# EAGLE design Task6PCB (EAGLE 9.6.0)
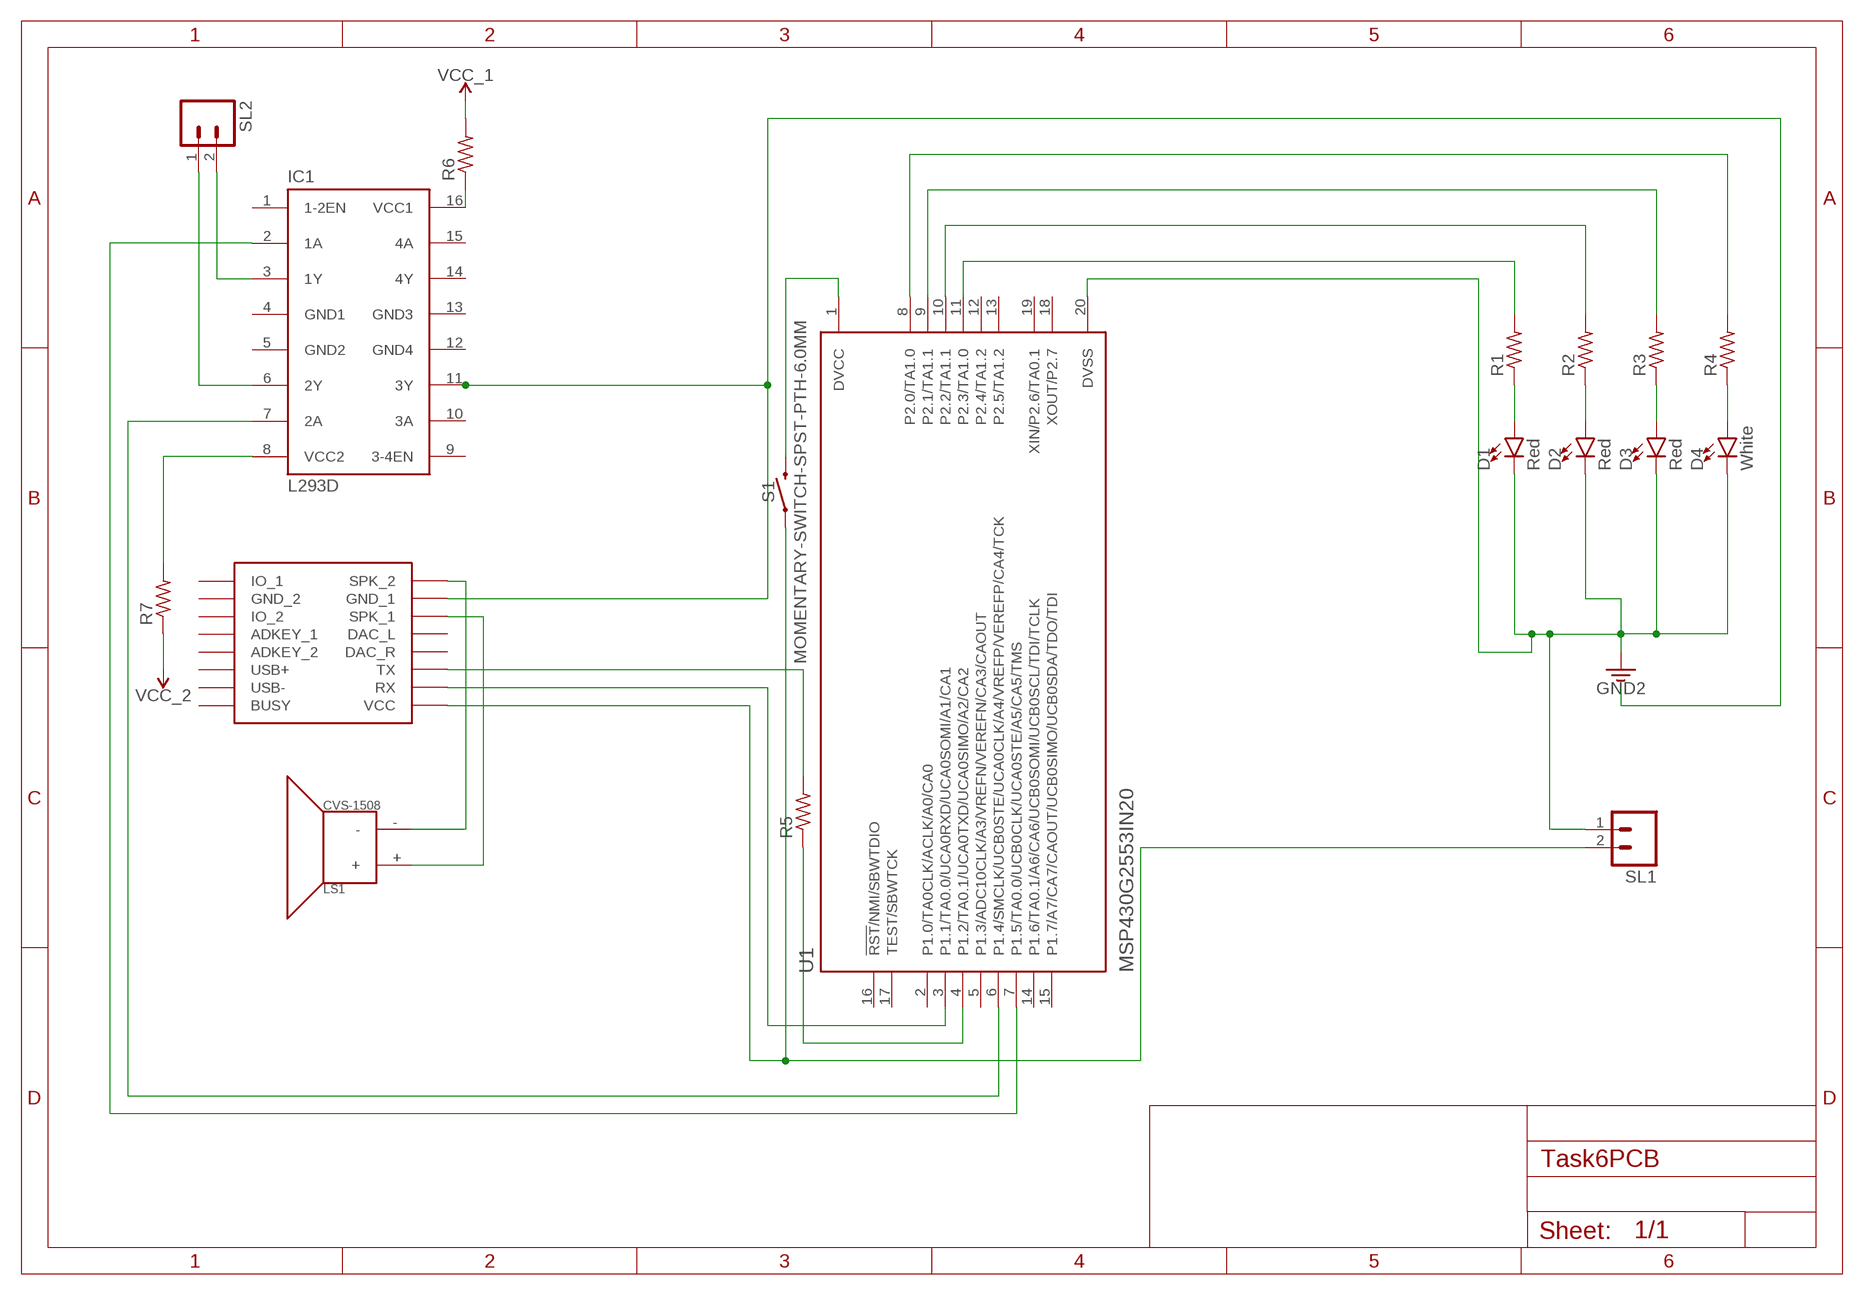
[diagram p0: schematic, sheet 1]

## Parts
D1  Red  LED-BLUE-0603-WE  [LED-0603]
D2  Red  LED-GREEN-0603-WE  [LED-0603]
D3  Red  LED-RED-0603-WE  [LED-0603]
D4  White  LED-PINK1206  [LED-1206]
IC1  L293D  [DIL16]
LS1  CVS-1508  SPEAKERCVS-1508  [CVS-1508_PCBSPKR]
R1  R-US_0204/7  [0204/7]
R2  R-US_0204/7  [0204/7]
R3  R-US_0204/7  [0204/7]
R4  R-US_0204/7  [0204/7]
R5  R-US_0204/7  [0204/7]
R6  R-US_0204/7  [0204/7]
R7  R-US_0204/7  [0204/7]
S1  MOMENTARY-SWITCH-SPST-PTH-6.0MM  [TACTILE_SWITCH_PTH_6.0MM]
SL1  M02  [02P]
SL2  M02  [02P]
U1  MSP430G2553IN20  [DIP794W45P254L2540H508Q20]
U$1  DFPLAYER  [DFPLAYER]

## Nets
3.3V: D1.C D2.C D3.C D4.C SL1.1 U1.20(DVSS) ; supply symbol labelled GND2
N$1: R5.1 U1.4(P1.2/TA0.1/UCA0TXD/UCA0SIMO/A2/CA2)
N$2: R2.2 U1.10(P2.2/TA1.1)
N$3: IC1.7(2A) U1.6(P1.4/SMCLK/UCB0STE/UCA0CLK/A4/VREFP/VEREFP/CA4/TCK)
N$4: IC1.8(VCC2) R7.2
N$5: D1.A R1.1
N$6: D4.A R4.1
N$7: R3.2 U1.9(P2.1/TA1.1)
N$8: D3.A R3.1
N$9: R4.2 U1.8(P2.0/TA1.0)
N$10: D2.A R2.1
N$11: U1.3(P1.1/TA0.0/UCA0RXD/UCA0SOMI/A1/CA1) U$1.RX
N$12: R5.2 U$1.TX
N$13: R1.2 U1.11(P2.3/TA1.0)
N$14: LS1.+ U$1.SPK1(SPK_1)
N$15: LS1.- U$1.SPK2(SPK_2)
N$16: IC1.16(VCC1) R6.1
N$17: S1.1 SL1.2 U$1.VCC
N$19: IC1.11(3Y) U$1.GND_1
N$20: IC1.3(1Y) SL2.2
N$21: IC1.6(2Y) SL2.1
N$22: S1.3 U1.1(DVCC)
N$24: IC1.2(1A) U1.7(P1.5/TA0.0/UCB0CLK/UCA0STE/A5/CA5/TMS)
VCC_1: R6.2
VCC_2: R7.1
Unconnected: IC1.1(1-2EN) IC1.9(3-4EN) IC1.10(3A) IC1.14(4Y) IC1.15(4A) U1.2(P1.0/TA0CLK/ACLK/A0/CA0) U1.5(P1.3/ADC10CLK/A3/VREFN/VEREFN/CA3/CAOUT) U1.12(P2.4/TA1.2) U1.13(P2.5/TA1.2) U1.14(P1.6/TA0.1/A6/CA6/UCB0SOMI/UCB0SCL/TDI/TCLK) U1.15(P1.7/A7/CA7/CAOUT/UCB0SIMO/UCB0SDA/TDO/TDI) U1.16(!RST!/NMI/SBWTDIO) U1.17(TEST/SBWTCK) U1.18(XOUT/P2.7) U1.19(XIN/P2.6/TA0.1) U$1.ADKEY1(ADKEY_1) U$1.ADKEY2(ADKEY_2) U$1.BUSY U$1.DAC_L U$1.DAC_R U$1.GND_2 U$1.IO1(IO_1) U$1.IO2(IO_2) U$1.USB+ U$1.USB-

## Power pins joined to a net without a drawn wire
GND1: IC1.4(GND1)
GND2: IC1.5(GND2)
GND3: IC1.13(GND3)
GND4: IC1.12(GND4)

## Library data of the parts
D1 = SparkFun-LED:LED-BLUE: Blue SMD LED Used in manufacturing of various products at SparkFun Packages: 0603 - SMD 0603 package [Product Link] <http://www.digikey.com/product-detail/en/SMLE12BC7TT86/511-1589-2-ND/1641808> 1206 - SMD1206 package [Product Link] <http://www.digikey.com/product-detail/en/lite-on-inc/LTST-C150TBKT/160-1643-1-ND/573584> SparkFun Products: ESP8266 Thing-Dev Board <https://www.sparkfun.com/products/13711> RedBoard <https://www.sparkfun.com/products/12757>; PROD_ID: DIO-16513; VALUE: Blue
D2 = SparkFun-LED:LED-GREEN: Green SMD LED Used in manufacturing of various products at SparkFun Packages: 0603 - SMD 0603 package [Product Link] <http://www.futureelectronics.com/en/technologies/semiconductors/optoelectronics/leds/Pages/9894312-LTST-C190GKT.aspx?CrossPart=HSMG-C190&IM=0> LilyPad 1206 - SMD1206 LilyPad package [Product Link] <http://www.futureelectronics.com/en/Technologies/Product.aspx?ProductID=IN150NGHARVATEKCORPORATION2049943&IM=0> 1206 - SMD1206 package [Product Link] <http://www.futureelectronics.com/en/technologies/semiconductors/optoelectronics/leds/Pages/8315665-LTST-C150KGKT.aspx?IM=0> 1206 Bottom Mount -SMD 1206 Bottom Mount [Product Link] <http://www.digikey.com/product-detail/en/lite-on-inc/LTST-C230KGKT/160-1456-1-ND/386854> SparkFun Products: Pro Mini 328 -5V <https://www.sparkfun.com/products/821> RedBoard <https://www.sparkfun.com/products/12757> MP3 Trigger <https://www.sparkfun.com/products/13720> Makey Makey <https://www.sparkfun.com/products/11076>; PROD_ID: DIO-16512; VALUE: Green
D3 = SparkFun-LED:LED-RED: Red SMD LED Used in manufacturing of most products at SparkFun Packages: 0603 - KB - KingBright (DIO-17976) SMD 0603 package [Datasheet] <https://www.kingbrightusa.com/images/catalog/SPEC/APT1608SURCK.pdf> 0603 - (DIO-00819, has gone EOL) SMD 0603 package 0603 SMART - SMD 0603 SMART package ( more efficient and expensive)[Product Link] <http://www.osram-os.com/Graphics/XPic2/00077099_0.pdf> 1206 - SMD1206 package [Product Link] <https://www.sparkfun.com/datasheets/DevTools/LilyPad/Q150OVS4.pdff> SparkFun Products: Pro Mini 328 -5V <https://www.sparkfun.com/products/821> RedBoard <https://www.sparkfun.com/products/12757> IOIO-OTG <https://www.sparkfun.com/products/13613>; PROD_ID: DIO-16511
D4 = SparkFun-LED:LED-PINK: Pink SMD LED Used in manufacturing of various products at SparkFun Packages: 0603 - SMD 0603 package [Product Link] <http://cdn.sparkfun.com/datasheets/Components/General/S1206PKSBJC.pdf> SparkFun Products: LilyPad LED Pink <https://www.sparkfun.com/products/10962>; PROD_ID: DIO-10415; VALUE: Pink
IC1 = st-microelectronics:L293D: PUSH-PULL 4 CHANNEL DRIVER; MPN: L293D; OC_FARNELL: 9589619; OC_NEWARK: 56P8249
LS1 = SparkFun-Electromechanical:SPEAKER: Speaker Generic 2-terminal loudspeakers SparkFun Products Speaker - PCB Mount <https://www.sparkfun.com/products/11089> (COM-11089); PROD_ID: COM-14823
R1-R7 = rcl:R-US_: RESISTOR, American symbol; SPICEPREFIX: R
S1 = SparkFun-Switches:MOMENTARY-SWITCH-SPST: Momentary Switch (Pushbutton) - SPST Normally-open (NO) SPST momentary switches (buttons, pushbuttons). Variants PTH-12MM - 12mm square, through-hole Momentary Pushbutton Switch - 12mm Square <https://www.sparkfun.com/products/9190> (COM-09190) PTH-6.0MM, PTH-6.0MM-KIT - 6.0mm square, through-hole Mini Pushbutton Switch <https://www.sparkfun.com/products/97> (COM-00097) KIT package intended for soldering kit's - only one side of pads' copper is exposed. PTH-RIGHT-ANGLE-KIT - Right-angle, through-hole Right Angle Tactile Button <https://www.sparkfun.com/products/10791> - Used on SparkFun BigTime Watch Kit <https://www.sparkfun.com/products/11734> SMD-12MM - 12mm square, surface-mount Tactile Button - SMD (12mm) <https://www.sparkfun.com/products/12993> (COM-12993) Used on SparkFun PicoBoard <https://www.sparkfun.com/products/11888> SMD-4.5MM - 4.5mm Square Trackball Switch Used on SparkFun Blackberry Trackballer Breakout <https://www.sparkfun.com/products/13169> SMD-4.6MMX2.8MM - 4.60mm x 2.80mm, surface mount Used on SparkFun Pro Micro - RP2040 <https://www.sparkfun.com/products/17717> SMD-5.2MM, SMD-5.2-REDUNDANT - 5.2mm square, surface-mount Mini Pushbutton Switch - SMD <https://www.sparkfun.com/products/8720> (COM-08720) Used on Arduino Pro Mini <https://www.sparkfun.com/products/11114> REDUNDANT package connects both switch circuits together SMD-6.0X3.5MM - 6.0 x 3.5mm, surface mount Momentary Reset Switch SMD <https://www.sparkfun.com/products/8229> (COM-08229) SMD-6.2MM-TALL - 6.2mm square, surface mount Tactile Button - SMD (6mm) <https://www.sparkfun.com/products/12992> Used on SparkFun Digital Sandbox <https://www.sparkfun.com/products/12651> SMD-RIGHT-ANGLE - Right-angle, surface mount Used on SparkFun Block for Intel® Edison - Arduino <https://www.sparkfun.com/products/13036>; PROD_ID: SWCH-08441; SF_SKU: COM-00097
SL1 SL2 = con-amp-quick:M02: AMP QUICK CONNECTOR; OC_FARNELL: unknown; OC_NEWARK: unknown
U1 = MSP430G2553IN20:MSP430G2553IN20: Check availability <https://pricing.snapeda.com/parts/MSP430G2553IN20/Texas%20Instruments/view-part?ref=eda>; AVAILABILITY: In Stock; CHECK_PRICES: https://www.snapeda.com/parts/MSP430G2553IN20/Texas+Instruments/view-part/?ref=eda; DESCRIPTION: 16 MHz MCU with 16KB Flash, 512B SRAM, comparator, UART/SPI/I2C, timer; MF: Texas Instruments; MP: MSP430G2553IN20; PACKAGE: PDIP-20 Texas Instruments; PRICE: None; PURCHASE-URL: https://www.snapeda.com/api/url_track_click_mouser/?unipart_id=46372&manufacturer=Texas Instruments&part_name=MSP430G2553IN20&search_term=None; SNAPEDA_LINK: https://www.snapeda.com/parts/MSP430G2553IN20/Texas+Instruments/view-part/?ref=snap
U$1 = DFPlayer_v1:DFPLAYER

## Board
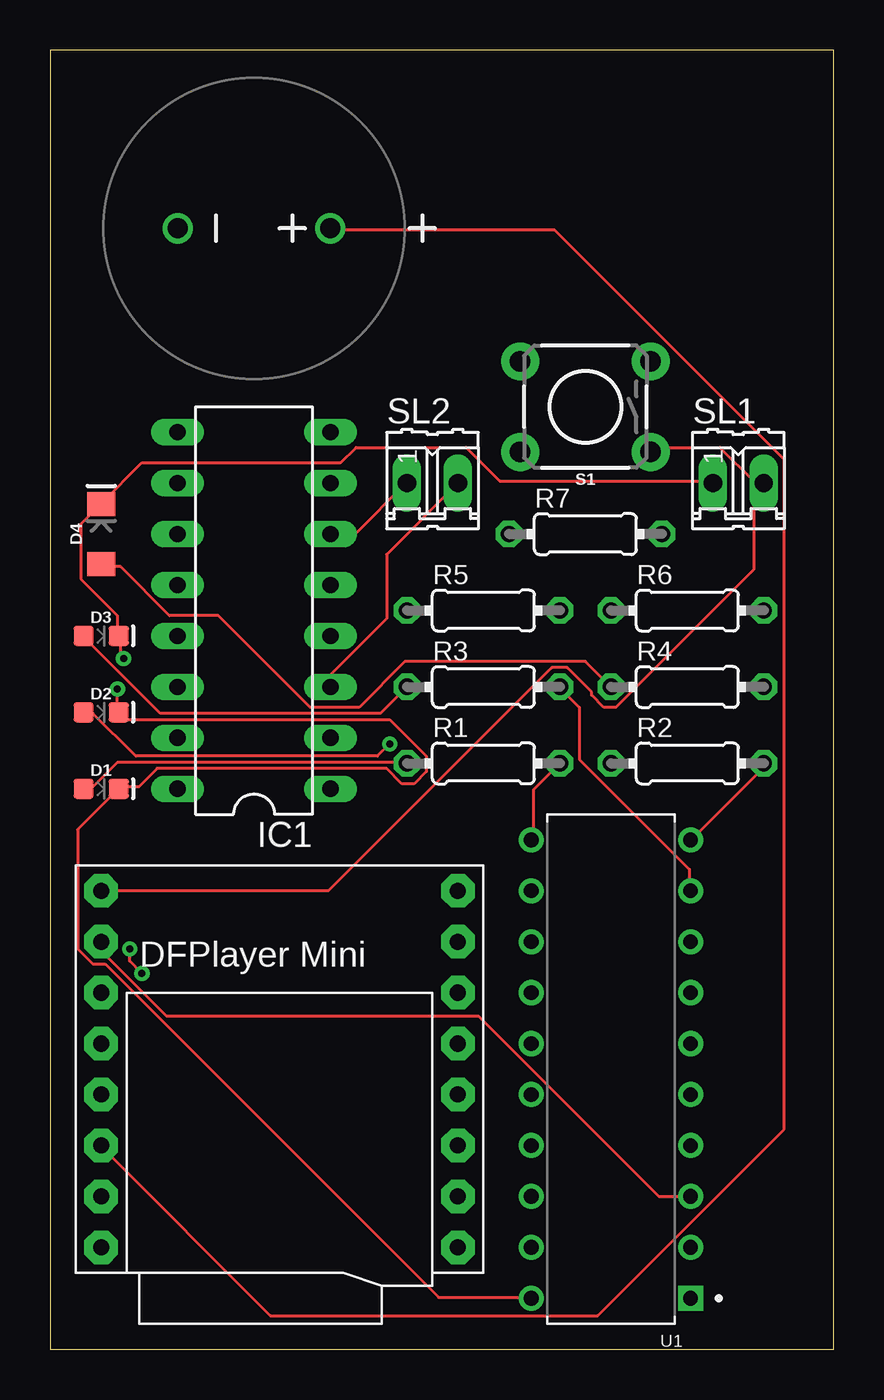
[diagram p1: board, top side]
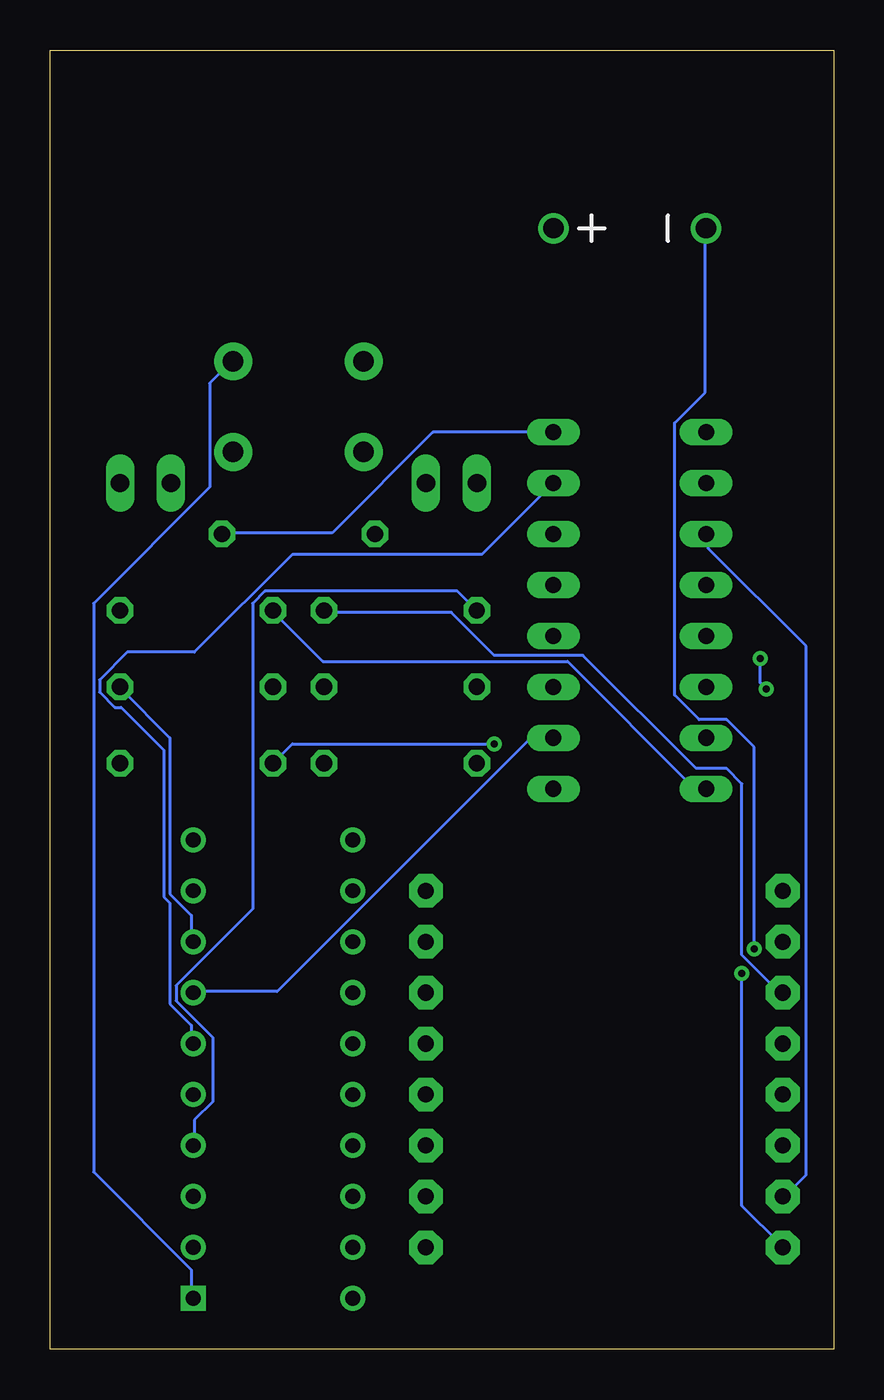
[diagram p2: board, bottom side, seen from below]

Size 39.04 x 64.76 mm. Coordinates in mm from the lower left corner, seen from the top.
Outline: 0,0 39.04,0 39.04,64.76 0,64.76 0,0
Copper layers (1*16): Top 0.035mm / dielectric 1.5mm / Bottom 0.035mm
Design rules "default": minimum track width 6mil, minimum drill 0.35mm, track to track 6mil, track to pad 6mil, pad to pad 6mil, via to via 6mil, smd to smd 6mil, copper to edge 40mil, drill to drill 6mil, minimum pad ring 10mil, minimum via ring 8mil, stop-mask expansion 4mil, vias tented up to drill 0mil, thermal gap 10mil

### Footprints (pad centres in the part's own frame; a part is rotated, then mirrored left to right if it is on the bottom)
LED-0603 = smd 1 x 1: A -0.877,0; C 0.877,0
LED-1206 = smd 1.2 x 1.4: A -1.5,0; C 1.5,0
DIL16 = drill 0.813 long: 1 -8.89,-3.81; 2 -6.35,-3.81; 3 -3.81,-3.81; 4 -1.27,-3.81; 5 1.27,-3.81; 6 3.81,-3.81; 7 6.35,-3.81; 8 8.89,-3.81; 9 8.89,3.81; 10 6.35,3.81; 11 3.81,3.81; 12 1.27,3.81; 13 -1.27,3.81; 14 -3.81,3.81; 15 -6.35,3.81; 16 -8.89,3.81
CVS-1508_PCBSPKR = drill 1: + 0,3.8; - 0,-3.8
0204/7 = drill 0.813 octagon: 1 -3.81,0; 2 3.81,0
TACTILE_SWITCH_PTH_6.0MM = drill 1.016 pad 1.88: 1 -3.251,2.261; 2 3.251,2.261; 3 -3.251,-2.261; 4 3.251,-2.261
02P = drill 0.914 long: 1 -1.27,0; 2 1.27,0
DIP794W45P254L2540H508Q20 = drill 0.74 pad 1.14 square: 1 -3.97,11.43 | drill 0.74 pad 1.14: 2 -3.97,8.89; 3 -3.97,6.35; 4 -3.97,3.81; 5 -3.97,1.27; 6 -3.97,-1.27; 7 -3.97,-3.81; 8 -3.97,-6.35; 9 -3.97,-8.89; 10 -3.97,-11.43; 11 3.97,-11.43; 12 3.97,-8.89; 13 3.97,-6.35; 14 3.97,-3.81; 15 3.97,-1.27; 16 3.97,1.27; 17 3.97,3.81; 18 3.97,6.35; 19 3.97,8.89; 20 3.97,11.43
DFPLAYER = drill 0.8 pad 1.676 octagon: ADKEY1 8.89,-1.27; ADKEY2 8.89,1.27; BUSY 8.89,8.89; DAC_L -8.89,-1.27; DAC_R -8.89,1.27; GND_1 -8.89,-6.35; GND_2 8.89,-6.35; IO1 8.89,-8.89; IO2 8.89,-3.81; RX -8.89,6.35; SPK1 -8.89,-3.81; SPK2 -8.89,-8.89; TX -8.89,3.81; USB+ 8.89,3.81; USB- 8.89,6.35; VCC -8.89,8.89

### Placement (x,y rotation side)
D1  2.54,27.94 0 top
D2  2.54,31.75 0 top
D3  2.54,35.56 0 top
D4  2.54,40.64 90 top
IC1  10.16,36.83 90 top
LS1  10.16,55.88 270 top
R1  21.59,29.21 0 top
R2  31.75,29.21 0 top
R3  21.59,33.02 0 top
R4  31.75,33.02 0 top
R5  21.59,36.83 0 top
R6  31.75,36.83 0 top
R7  26.67,40.64 0 top
S1  26.67,46.99 180 top
SL1  34.29,43.18 0 top
SL2  19.05,43.18 0 top
U1  27.94,13.97 180 top
U$1  11.43,13.97 0 top

### Tracks (layer width: path | path; a pad name or v marks a point on that pad's centre or on a via)
3.3V  (via drill 0.35)
  Top 0.152: SL1.1 32.92,43.28 22.4,43.28 20.73,44.96 15.24,44.96 14.48,44.2 4.57,44.2 2.59,42.22 D4.C 2.44,42.06 1.52,41.15 1.52,38.41 3.35,36.58 3.35,35.66 D3.C 3.5,35.51 3.5,34.59 v3.66,34.44 | U1.20 23.93,2.59 19.36,2.59 2.74,19.2 2.13,19.2 1.37,19.96 1.37,25.91 3.35,27.89 D1.C 3.5,28.04 4.42,28.04 5.33,28.96 16.76,28.96 17.53,28.19 18.14,28.19 18.75,28.8 18.75,29.57 16.92,31.39 3.81,31.39 3.5,31.7 D2.C 3.35,31.85 v3.35,32.92
  Bottom 0.152: v3.66,34.44 3.66,33.22 v3.35,32.92
N$1
  Bottom 0.152: R5.1 18.75,37.8 28.35,37.8 28.96,37.19 28.96,21.95 32.77,18.14 32.77,17.37 30.94,15.54 30.94,12.34 31.85,11.43 31.85,10.21 U1.4
N$2
  Top 0.152: U1.10 32,25.45 35.66,29.11 R2.2
N$3
  Bottom 0.152: IC1.7 17.53,39.62 26.98,39.62 31.85,34.75 35.2,34.75 36.58,33.38 36.58,32.77 35.81,32 35.51,32 33.38,29.87 33.38,22.55 33.07,22.25 33.07,17.22 32,16.15 32,15.24 U1.6
N$4
  Bottom 0.152: IC1.8 19.96,45.72 24.99,40.69 30.48,40.69 R7.2
N$5
  Top 0.152: D1.A 1.68,28.04 2.13,28.04 3.35,29.26 17.68,29.26 R1.1
N$6
  Top 0.152: R4.1 26.67,34.29 17.68,34.29 15.39,32 12.95,32 8.38,36.58 5.94,36.58 3.5,39.01 2.59,39.01 D4.A
N$7
  Top 0.152: U1.9 31.85,22.86 31.85,23.93 26.36,29.41 26.36,32 25.45,32.92 R3.2
N$8
  Top 0.152: R3.1 16.46,31.7 5.49,31.7 1.68,35.51 D3.A
N$9
  Bottom 0.152: U1.8 32,20.42 32,21.64 33.07,22.71 33.07,30.48 35.51,32.92 R4.2
N$10  (via drill 0.35)
  Top 0.152: v16.92,30.18 16.31,29.57 4.27,29.57 2.13,31.7 1.68,31.7 D2.A
  Bottom 0.152: v16.92,30.18 26.98,30.18 R2.1
N$11
  Top 0.152: U1.3 30.33,7.62 21.34,16.61 5.79,16.61 2.59,19.81 2.59,20.27 U$1.RX
N$12
  Bottom 0.152: R5.2 25.3,36.73 19.05,36.73 16.92,34.59 12.5,34.59 6.86,28.96 5.33,28.96 4.57,28.19 4.57,19.66 2.59,17.68 U$1.TX
N$13
  Top 0.152: R1.2 24.08,27.89 24.08,25.45 U1.11
N$14
  Top 0.152: LS1.+ 14.02,55.78 25.15,55.78 36.58,44.35 36.58,10.97 27.28,1.68 10.97,1.68 2.59,10.06 U$1.SPK1
N$15  (via drill 0.35)
  Top 0.152: v3.96,19.96 3.96,19.36 v4.57,18.75
  Bottom 0.152: v3.96,19.96 3.96,30.02 5.33,31.39 6.71,31.39 7.92,32.61 7.92,46.18 6.4,47.7 6.4,55.78 LS1.- | v4.57,18.75 4.57,7.16 2.59,5.18 U$1.SPK2
N$16
  Bottom 0.152: IC1.16 6.4,28.04 7.01,28.04 13.26,34.29 25.45,34.29 27.89,36.73 R6.1
N$17
  Top 0.152: 35.05,43.28 35.51,43.28 SL1.2 35.05,43.28 | 35.05,43.28 33.38,44.96 30.18,44.96 30.02,44.81 S1.1 | U$1.VCC 13.87,22.86 24.99,33.98 25.76,33.98 26.98,32.77 26.98,32.61 27.58,32 28.19,32 35.05,38.86 35.05,43.28
N$19
  Bottom 0.152: IC1.11 6.25,40.54 6.25,39.93 1.37,35.05 1.37,8.69 2.44,7.62 U$1.GND_1
N$20
  Top 0.152: SL2.2 16.76,39.62 16.76,36.42 14.02,33.68 14.02,33.07 IC1.3
N$21
  Top 0.152: IC1.6 14.02,40.69 15.24,40.69 17.68,43.13 SL2.1
N$22
  Bottom 0.152: U1.1 32,2.59 32,3.96 36.88,8.84 36.88,37.19 31.09,42.98 31.09,48.16 30.02,49.23 S1.3
N$24
  Bottom 0.152: IC1.2 15.09,30.48 27.74,17.83 31.85,17.83 U1.7